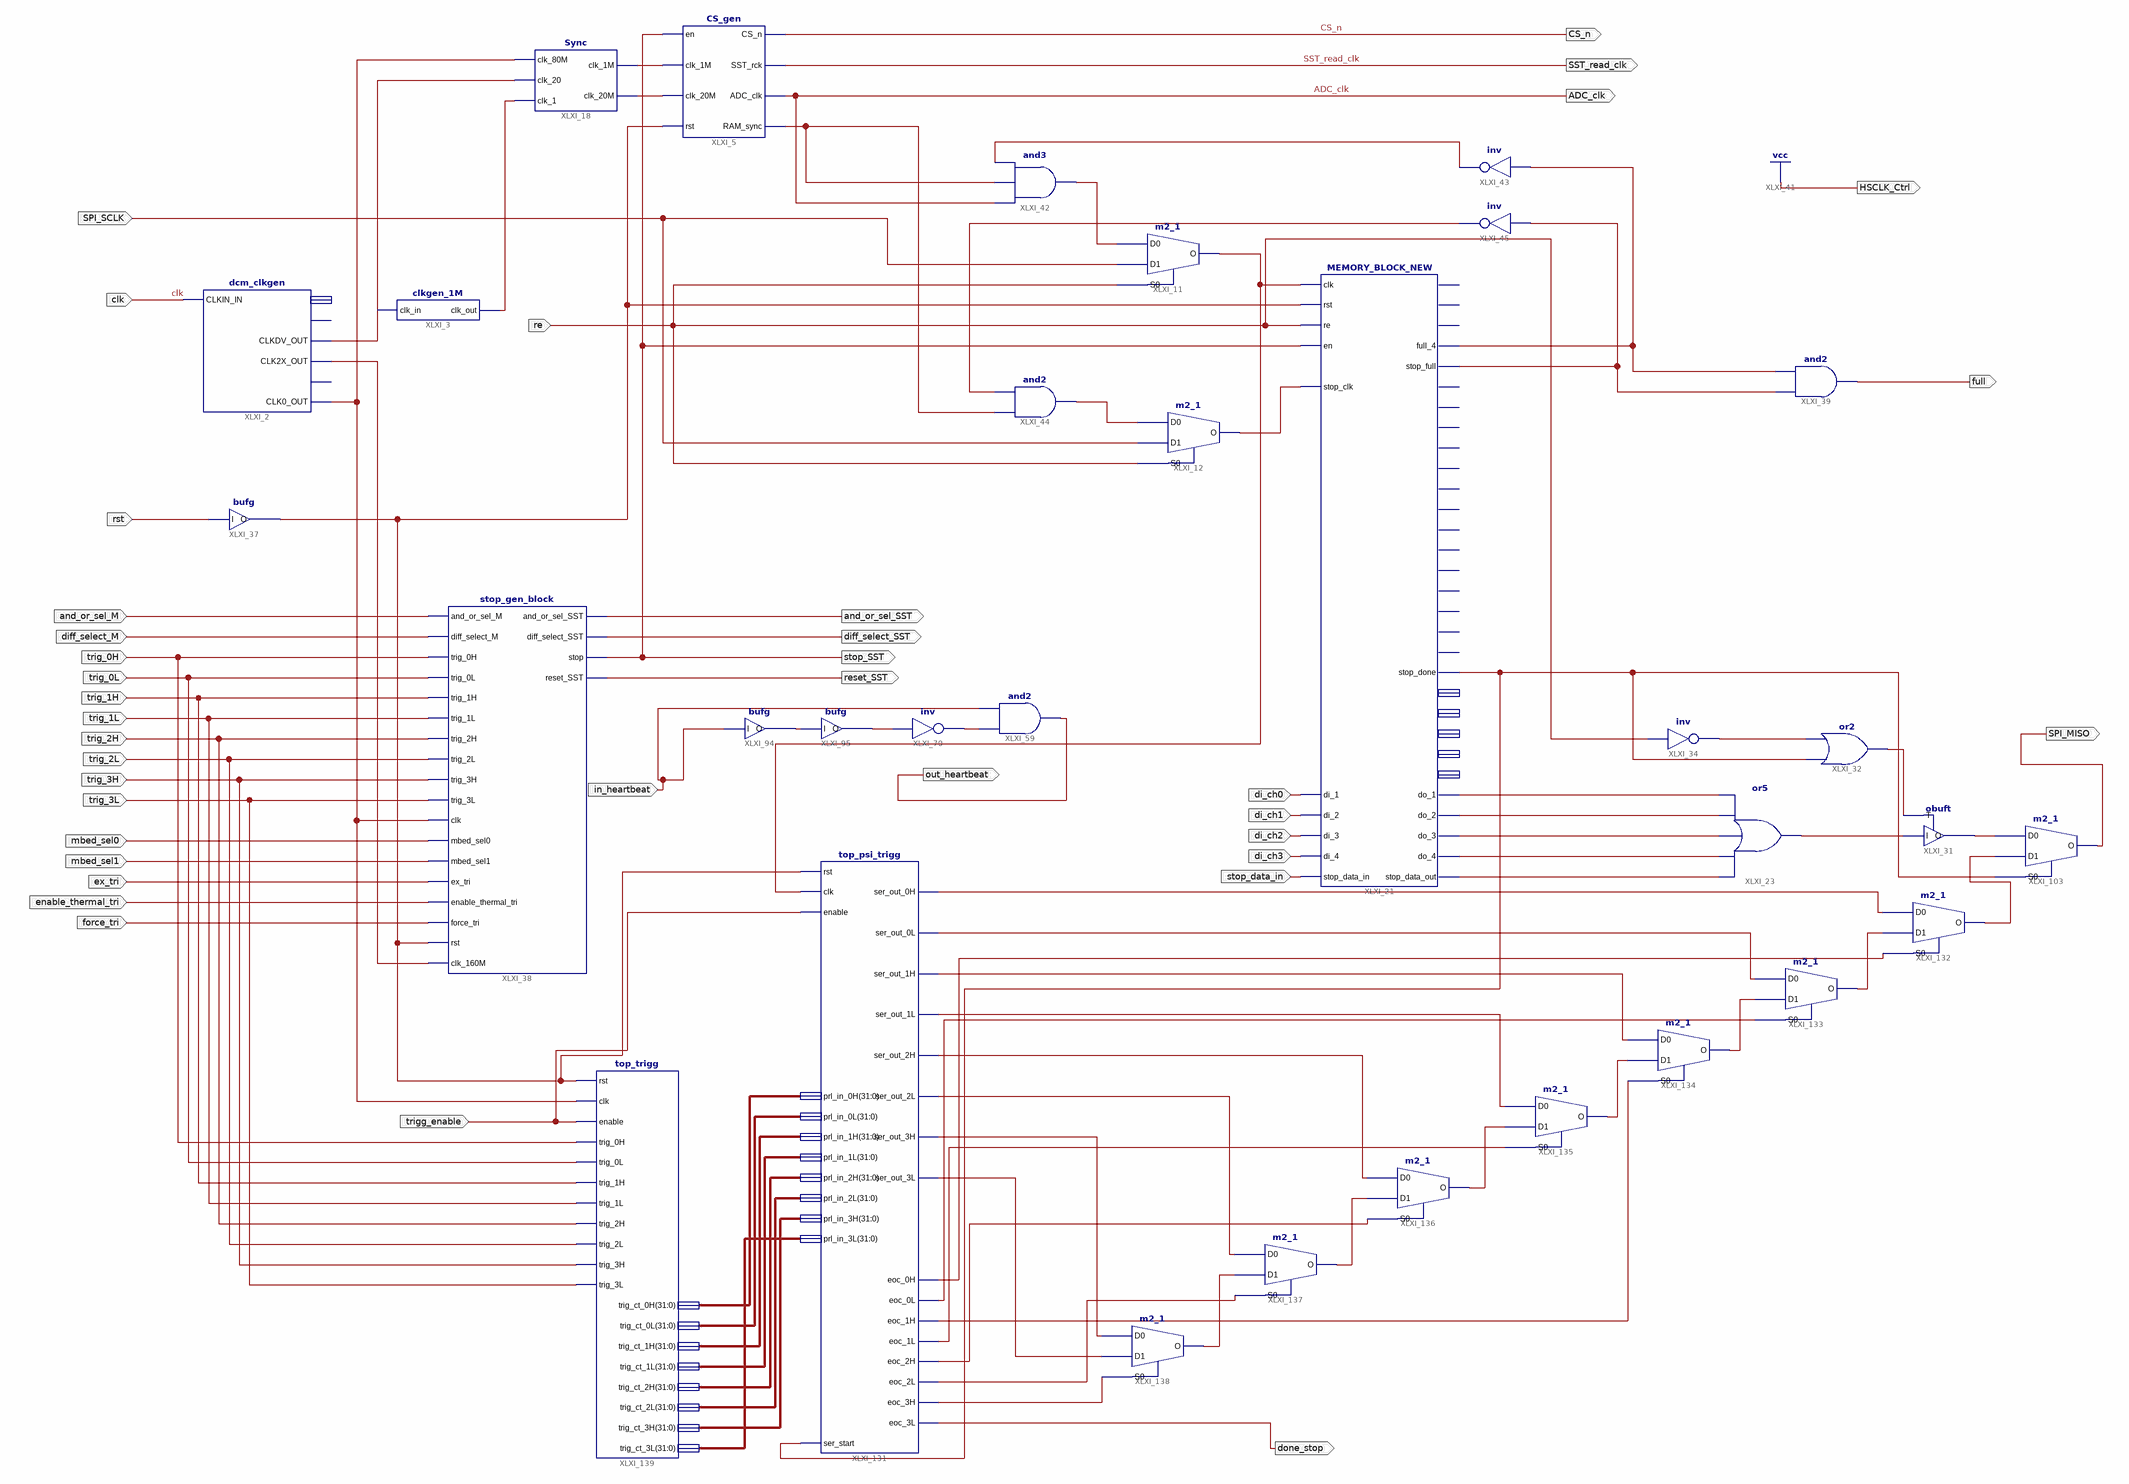
[diagram p0: schematic sheet 1]
// Xilinx ISE schematic Firmware_Top.sch (spartan3a) as structural Verilog: 32 symbols, 38 ports
module Firmware_Top (
  input  clk,
  input  re,
  input  SPI_SCLK,
  input  rst,
  input  force_tri,
  input  enable_thermal_tri,
  input  ex_tri,
  input  mbed_sel1,
  input  diff_select_M,
  input  and_or_sel_M,
  input  di_ch0,
  input  di_ch1,
  input  di_ch2,
  input  di_ch3,
  input  stop_data_in,
  input  in_heartbeat,
  input  mbed_sel0,
  input  trig_0H,
  input  trig_0L,
  input  trig_1H,
  input  trig_1L,
  input  trig_2H,
  input  trig_2L,
  input  trig_3H,
  input  trig_3L,
  input  trigg_enable,
  output CS_n,
  output SST_read_clk,
  output stop_SST,
  output diff_select_SST,
  output and_or_sel_SST,
  output ADC_clk,
  output full,
  output HSCLK_Ctrl,
  output reset_SST,
  output SPI_MISO,
  output out_heartbeat,
  output done_stop
);

  wire clk_1M, clk_20M, clk_test_stop, data_0, data_1, data_2, data_3, full_3, or_data, RAM_sync, stop_data,
       tri_ctrl, trigg_rst, XLXN_32, XLXN_33, XLXN_147, XLXN_424, XLXN_426, XLXN_427, XLXN_429, XLXN_431,
       XLXN_442, XLXN_469, XLXN_487, XLXN_488, XLXN_522, XLXN_658, XLXN_710, XLXN_711, XLXN_712, XLXN_713,
       XLXN_714, XLXN_715, XLXN_716, XLXN_717, XLXN_718, XLXN_719, XLXN_720, XLXN_721, XLXN_722, XLXN_723,
       XLXN_724, XLXN_725, XLXN_726, XLXN_727, XLXN_728, XLXN_729, XLXN_730, XLXN_731, XLXN_763, XLXN_781;
  wire [31:0] XLXN_782, XLXN_784, XLXN_785, XLXN_786, XLXN_787, XLXN_788, XLXN_789, XLXN_790;

  dcm_clkgen XLXI_2 (
    .CLKIN_IN(clk), .CLKDV_OUT(clk_20M), .CLK2X_OUT(XLXN_442), .CLK0_OUT(XLXN_781));  // open: STATUS_OUT, LOCKED_OUT, CLKIN_IBUFG_OUT
  Sync XLXI_18 (.clk_80M(XLXN_781), .clk_20(clk_20M), .clk_1(clk_1M), .clk_1M(XLXN_33), .clk_20M(XLXN_32));
  clkgen_1M XLXI_3 (.clk_in(clk_20M), .clk_out(clk_1M));
  CS_gen XLXI_5 (
    .en(stop_SST), .clk_1M(XLXN_33), .clk_20M(XLXN_32), .rst(trigg_rst), .ADC_clk(ADC_clk),
    .SST_rck(SST_read_clk), .CS_n(CS_n), .RAM_sync(RAM_sync));
  m2_1 XLXI_12 (.D0(XLXN_427), .D1(SPI_SCLK), .S0(re), .O(clk_test_stop));
  m2_1 XLXI_11 (.D0(XLXN_424), .D1(SPI_SCLK), .S0(re), .O(XLXN_658));
  bufg XLXI_37 (.I(rst), .O(trigg_rst));
  stop_gen_block XLXI_38 (
    .force_tri(force_tri), .enable_thermal_tri(enable_thermal_tri), .ex_tri(ex_tri), .mbed_sel1(mbed_sel1),
    .mbed_sel0(mbed_sel0), .trig_3L(trig_3L), .trig_3H(trig_3H), .trig_2L(trig_2L), .trig_2H(trig_2H),
    .trig_1L(trig_1L), .trig_1H(trig_1H), .trig_0L(trig_0L), .trig_0H(trig_0H),
    .diff_select_M(diff_select_M), .and_or_sel_M(and_or_sel_M), .clk(XLXN_781), .rst(trigg_rst),
    .and_or_sel_SST(and_or_sel_SST), .diff_select_SST(diff_select_SST), .stop(stop_SST),
    .reset_SST(reset_SST), .clk_160M(XLXN_442));
  not XLXI_34 (XLXN_147, re);
  or XLXI_32 (tri_ctrl, XLXN_763, XLXN_147);
  obuft XLXI_31 (.I(or_data), .T(tri_ctrl), .O(XLXN_522));
  or XLXI_23 (or_data, stop_data, data_3, data_2, data_1, data_0);
  MEMORY_BLOCK_NEW XLXI_21 (
    .en(stop_SST), .clk(XLXN_658), .rst(trigg_rst), .re(re), .di_1(di_ch0), .di_2(di_ch1), .di_3(di_ch2),
    .di_4(di_ch3), .stop_clk(clk_test_stop), .stop_data_in(stop_data_in), .full_4(full_3),
    .stop_done(XLXN_763), .stop_full(XLXN_429), .stop_data_out(stop_data), .do_4(data_3), .do_3(data_2),
    .do_2(data_1), .do_1(data_0));  // open: start_1, start_2, start_3, start_4, stop_start, address_1, done_1, full_1, wait_sig_1, address_3, address_2, address_4, done_2, full_2, wait_sig_2, done_3, full_3, wait_sig_3, done_4, wait_sig_4, stop_address, stop_wait
  and XLXI_39 (full, XLXN_429, full_3);
  not XLXI_43 (XLXN_426, full_3);
  and XLXI_44 (XLXN_427, RAM_sync, XLXN_431);
  and XLXI_42 (XLXN_424, ADC_clk, RAM_sync, XLXN_426);
  not XLXI_45 (XLXN_431, XLXN_429);
  m2_1 XLXI_103 (.D0(XLXN_522), .D1(XLXN_716), .S0(XLXN_763), .O(SPI_MISO));
  bufg XLXI_95 (.I(XLXN_487), .O(XLXN_488));
  bufg XLXI_94 (.I(in_heartbeat), .O(XLXN_487));
  not XLXI_70 (XLXN_469, XLXN_488);
  and XLXI_59 (out_heartbeat, XLXN_469, in_heartbeat);
  top_psi_trigg XLXI_131 (
    .rst(trigg_rst), .clk(XLXN_658), .enable(trigg_enable), .ser_start(XLXN_763), .prl_in_0H(XLXN_782),
    .prl_in_0L(XLXN_784), .prl_in_1H(XLXN_785), .prl_in_1L(XLXN_786), .prl_in_2H(XLXN_787),
    .prl_in_2L(XLXN_788), .prl_in_3H(XLXN_789), .prl_in_3L(XLXN_790), .eoc_0H(XLXN_727),
    .ser_out_0H(XLXN_726), .eoc_0L(XLXN_731), .ser_out_0L(XLXN_725), .eoc_1H(XLXN_730),
    .ser_out_1H(XLXN_724), .eoc_1L(XLXN_729), .ser_out_1L(XLXN_723), .eoc_2H(XLXN_728),
    .ser_out_2H(XLXN_722), .eoc_2L(XLXN_720), .ser_out_2L(XLXN_721), .eoc_3H(XLXN_719),
    .ser_out_3H(XLXN_718), .eoc_3L(done_stop), .ser_out_3L(XLXN_717));
  m2_1 XLXI_132 (.D0(XLXN_726), .D1(XLXN_715), .S0(XLXN_727), .O(XLXN_716));
  m2_1 XLXI_133 (.D0(XLXN_725), .D1(XLXN_714), .S0(XLXN_731), .O(XLXN_715));
  m2_1 XLXI_134 (.D0(XLXN_724), .D1(XLXN_713), .S0(XLXN_730), .O(XLXN_714));
  m2_1 XLXI_135 (.D0(XLXN_723), .D1(XLXN_712), .S0(XLXN_729), .O(XLXN_713));
  m2_1 XLXI_136 (.D0(XLXN_722), .D1(XLXN_711), .S0(XLXN_728), .O(XLXN_712));
  m2_1 XLXI_137 (.D0(XLXN_721), .D1(XLXN_710), .S0(XLXN_720), .O(XLXN_711));
  m2_1 XLXI_138 (.D0(XLXN_718), .D1(XLXN_717), .S0(XLXN_719), .O(XLXN_710));
  top_trigg XLXI_139 (
    .rst(trigg_rst), .clk(XLXN_781), .enable(trigg_enable), .trig_0H(trig_0H), .trig_0L(trig_0L),
    .trig_1H(trig_1H), .trig_1L(trig_1L), .trig_2H(trig_2H), .trig_2L(trig_2L), .trig_3L(trig_3L),
    .trig_3H(trig_3H), .trig_ct_0H(XLXN_782), .trig_ct_0L(XLXN_784), .trig_ct_1H(XLXN_785),
    .trig_ct_1L(XLXN_786), .trig_ct_2H(XLXN_787), .trig_ct_2L(XLXN_788), .trig_ct_3H(XLXN_789),
    .trig_ct_3L(XLXN_790));

  assign HSCLK_Ctrl = 1'b1;
endmodule
